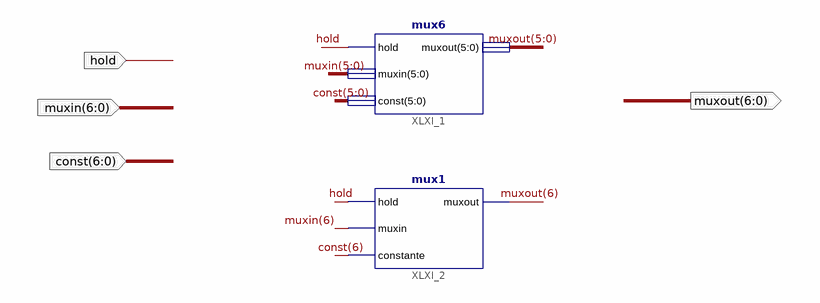
[diagram p0: schematic sheet 1]
// Xilinx ISE schematic mux7.sch (artix7) as structural Verilog: 2 symbols, 4 ports
module mux7 (
  input  hold,
  input  [6:0] muxin,
  input  [6:0] \const ,
  output [6:0] muxout
);

  mux6 XLXI_1 (.hold(hold), .muxin(muxin[5:0]), .\const (\const [5:0]), .muxout(muxout[5:0]));
  mux1 XLXI_2 (.hold(hold), .muxin(muxin[6]), .constante(\const [6]), .muxout(muxout[6]));
endmodule
